# Altium project BLDCdriverI2C.PrjPcb
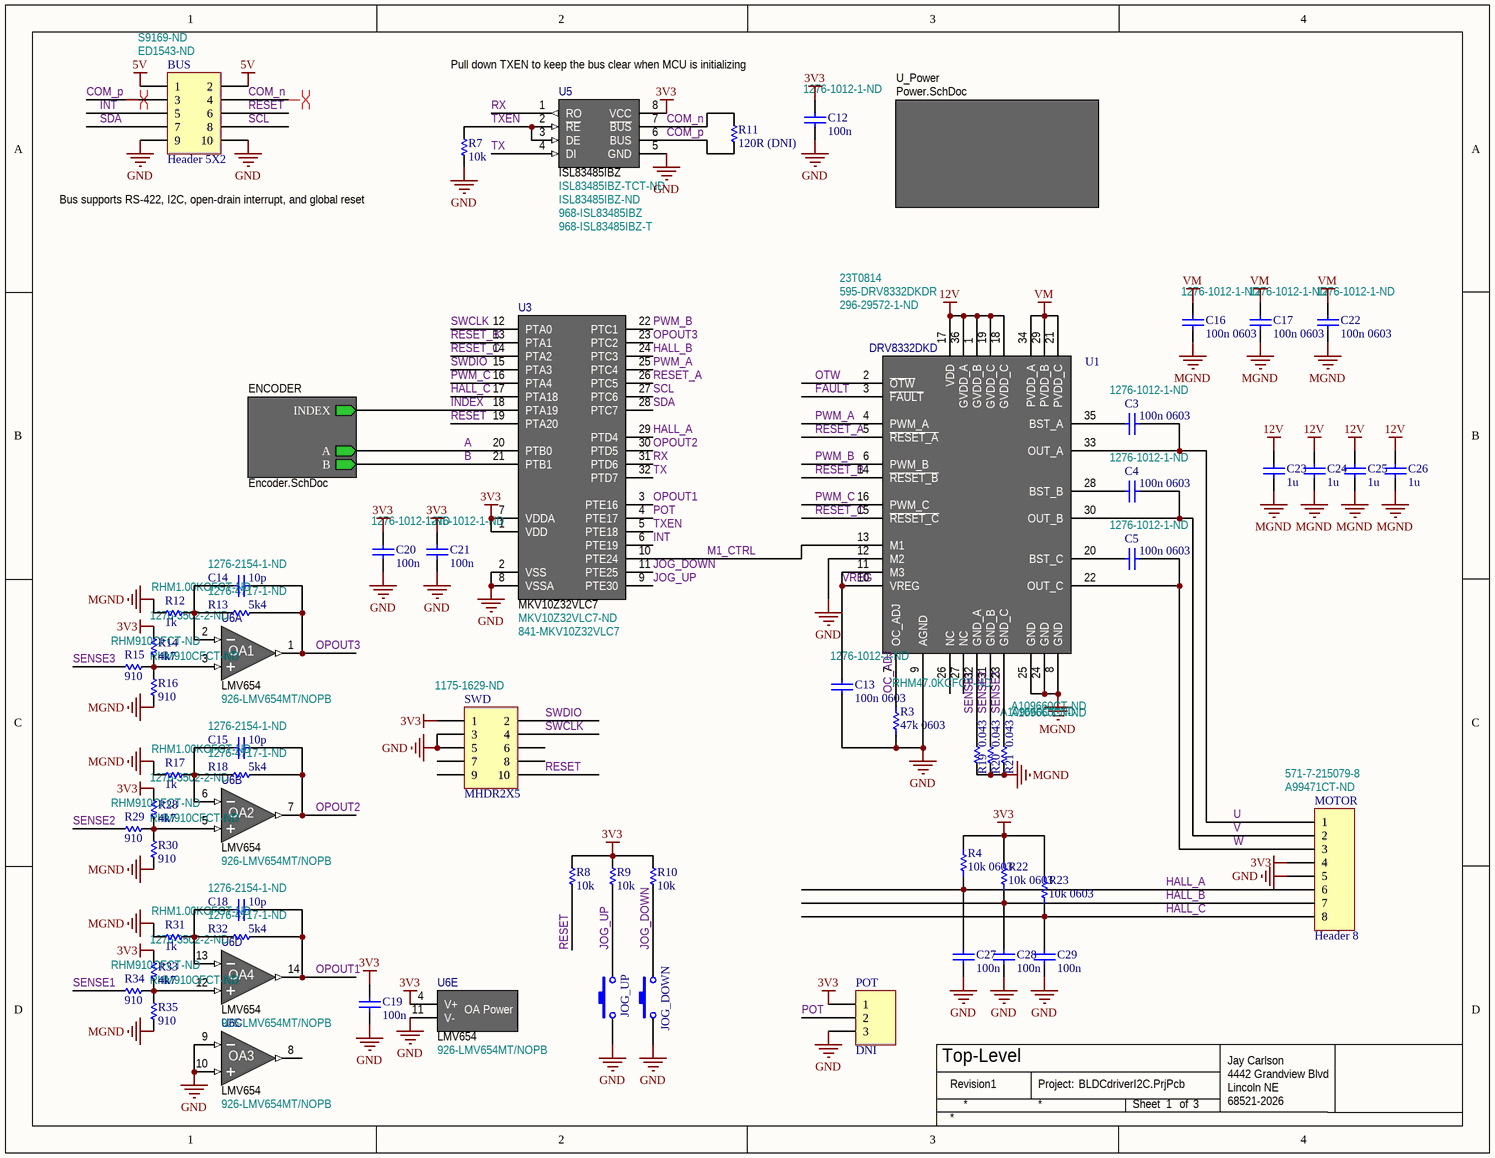
[diagram p0: Top.SchDoc]
3 sheets, 77 parts. Net scope: hierarchical (ports join the sheet entries above them; power ports are global).
Board file: PCB.PcbDoc
Sheets:
  Top.SchDoc
    ENCODER = Encoder.SchDoc
    U_Power = Power.SchDoc

## Sheet Top.SchDoc: Top-Level
size Letter; Organization: Altium Limited; Address1: L3, 12a Rodborough Rd; Address2: Frenchs Forest; Address3: NSW; Address4: Australia 2086; DocumentNumber: 4; Revision: 1; SheetNumber: 1; SheetTotal: 3

### Parts
BUS  Header 5X2  Supplier Part Number 1: ED1543-ND  Supplier Part Number 2: S9169-ND  [HDR2X5_SHROUDED]
C3  100n 0603  Supplier Part Number 1: 1276-1012-1-ND  [CAPC1608N]
C4  100n 0603  Supplier Part Number 1: 1276-1012-1-ND  [CAPC1608N]
C5  100n 0603  Supplier Part Number 1: 1276-1012-1-ND  [CAPC1608N]
C12  100n  Supplier Part Number 1: 1276-1012-1-ND  [CAPC1608N]
C13  100n 0603  Supplier Part Number 1: 1276-1012-1-ND  [CAPC1608N]
C14  10p  Supplier Part Number 1: 1276-2154-1-ND  [CAPC1608N]
C15  10p  Supplier Part Number 1: 1276-2154-1-ND  [CAPC1608N]
C16  100n 0603  Supplier Part Number 1: 1276-1012-1-ND  [CAPC1608N]
C17  100n 0603  Supplier Part Number 1: 1276-1012-1-ND  [CAPC1608N]
C18  10p  Supplier Part Number 1: 1276-2154-1-ND  [CAPC1608N]
C19  100n  [CAPC1608N]
C20  100n  Supplier Part Number 1: 1276-1012-1-ND  [CAPC1608N]
C21  100n  Supplier Part Number 1: 1276-1012-1-ND  [CAPC1608N]
C22  100n 0603  Supplier Part Number 1: 1276-1012-1-ND  [CAPC1608N]
C23  1u  [CAPC1608N]
C24  1u  [CAPC1608N]
C25  1u  [CAPC1608N]
C26  1u  [CAPC1608N]
C27  100n  [CAPC1608N]
C28  100n  [CAPC1608N]
C29  100n  [CAPC1608N]
JOG_DOWN  SW-PB  [SW/PB-SMD/H8]  (value not drawn)
JOG_UP  SW-PB  [SW/PB-SMD/H8]  (value not drawn)
MOTOR  Header 8  Supplier Part Number 1: A99471CT-ND  Supplier Part Number 2: 571-7-215079-8  [7-215079-8]
POT  DNI  [HDR1X3]  (no BOM)
R3  47k 0603  Supplier Part Number 1: RHM47.0KCFCT-ND  [RESC1608N]
R4  10k 0603  [RESC1608N]
R7  10k  [RESC1608N]
R8  10k  [RESC1608N]
R9  10k  [RESC1608N]
R10  10k  [RESC1608N]
R11  120R (DNI)  [RESC1608N]
R12  1k  Supplier Part Number 1: RHM1.00KCFCT-ND  [RESC1608N]
R13  5k4  Supplier Part Number 1: 1276-4717-1-ND  [RESC1608N]
R14  4k7  Supplier Part Number 1: 1276-3502-2-ND  [RESC1608N]
R15  910  Supplier Part Number 1: RHM910CFCT-ND  [RESC1608N]
R16  910  Supplier Part Number 1: RHM910CFCT-ND  [RESC1608N]
R17  1k  Supplier Part Number 1: RHM1.00KCFCT-ND  [RESC1608N]
R18  5k4  Supplier Part Number 1: 1276-4717-1-ND  [RESC1608N]
R19  0.043  Supplier Part Number 1: A109660CT-ND  [RESC3216N]
R20  0.043  Supplier Part Number 1: A109660CT-ND  [RESC3216N]
R21  0.043  Supplier Part Number 1: A109660CT-ND  [RESC3216N]
R22  10k 0603  [RESC1608N]
R23  10k 0603  [RESC1608N]
R28  4k7  Supplier Part Number 1: 1276-3502-2-ND  [RESC1608N]
R29  910  Supplier Part Number 1: RHM910CFCT-ND  [RESC1608N]
R30  910  Supplier Part Number 1: RHM910CFCT-ND  [RESC1608N]
R31  1k  Supplier Part Number 1: RHM1.00KCFCT-ND  [RESC1608N]
R32  5k4  Supplier Part Number 1: 1276-4717-1-ND  [RESC1608N]
R33  4k7  Supplier Part Number 1: 1276-3502-2-ND  [RESC1608N]
R34  910  Supplier Part Number 1: RHM910CFCT-ND  [RESC1608N]
R35  910  Supplier Part Number 1: RHM910CFCT-ND  [RESC1608N]
SWD  MHDR2X5  Supplier Part Number 1: 1175-1629-ND  [MHDR2X5SMD_SHROUD]
U1  DRV8332DKD  Supplier Part Number 1: 296-29572-1-ND  Supplier Part Number 2: 595-DRV8332DKDR  Supplier Part Number 3: 23T0814  [DKD36]
U3  MKV10Z32VLC7  Supplier Part Number 1: MKV10Z32VLC7-ND  Supplier Part Number 2: 841-MKV10Z32VLC7  [QFP80P900X900-32N]
U5  ISL83485IBZ  Supplier Part Number 1: ISL83485IBZ-TCT-ND  Supplier Part Number 2: ISL83485IBZ-ND  Supplier Part Number 3: 968-ISL83485IBZ  Supplier Part Number 4: 968-ISL83485IBZ-T  [SOIC127P600-8N]
U6  LMV654  Supplier Part Number 2: 926-LMV654MT/NOPB  [TSOP65P640-14AN]  (parts A,B,C,D,E of 5)

### Sub-sheets
ENCODER = Encoder.SchDoc: A (out), B (out), INDEX (out)
U_Power = Power.SchDoc: no entries

### Nets
3V3: C12.2 C19.2 C20.2 C21.2 MOTOR.4 POT.1 R4.1 R8.2 R9.2 R10.2 R14.2 R22.1 R23.1 R28.2 R33.2 SWD.1 U3.1(VDD) U3.7(VDDA) U5.8(VCC) U6.4(V+)
5V: BUS.1 BUS.2
12V: C23.2 C24.2 C25.2 C26.2 U1.1(GVDD_B) U1.17(VDD) U1.18(GVDD_C) U1.19(GVDD_C) U1.36(GVDD_A)
GND: BUS.9 BUS.10 C12.1 C13.2 C19.1 C20.1 C21.1 C27.1 C28.1 C29.1 JOG_DOWN.1 JOG_UP.1 MOTOR.5 POT.3 R3.2 R7.1 SWD.3 SWD.5 U1.9(AGND) U1.12(M2) U3.2(VSS) U3.8(VSSA) U5.5(GND) U6.9(IN_C-) U6.10(IN_C+) U6.11(V-)
MGND: C16.2 C17.2 C22.2 C23.1 C24.1 C25.1 C26.1 R12.1 R16.1 R17.1 R19.1 R20.1 R21.1 R30.1 R31.1 R35.1 U1.8(GND) U1.24(GND) U1.25(GND)
VM: C16.1 C17.1 C22.1 U1.21(PVDD_C) U1.29(PVDD_B) U1.34(PVDD_A)
A: U3.20(PTB0) ; sheet ENCODER/A
B: U3.21(PTB1) ; sheet ENCODER/B
COM_n: BUS.4 R11.2 U5.7(~{BUS})
COM_p: BUS.3 R11.1 U5.6(BUS)
FAULT: U1.3(~{FAULT})
HALL_A: C27.2 MOTOR.6 R4.2 U3.29(PTD4)
HALL_B: C28.2 MOTOR.7 R22.2 U3.24(PTC3)
HALL_C: C29.2 MOTOR.8 R23.2 U3.17(PTA18)
INDEX: U3.18(PTA19) ; sheet ENCODER/INDEX
INT: BUS.5 U3.6(PTE19)
JOG_DOWN: JOG_DOWN.2 R10.1 U3.11(PTE25)
JOG_UP: JOG_UP.2 R9.1 U3.9(PTE30)
M1_CTRL: U1.13(M1) U3.10(PTE24)
OC_ADJ: R3.1 U1.7(OC_ADJ)
OPOUT1: C18.2 R32.2 U3.3(PTE16) U6.14(OUT_D)
OPOUT2: C15.2 R18.2 U3.30(PTD5) U6.7(OUT_B)
OPOUT3: C14.2 R13.2 U3.23(PTC2) U6.1(OUT_A)
OTW: U1.2(~{OTW})
POT: POT.2 U3.4(PTE17)
PWM_A: U1.4(PWM_A) U3.25(PTC4)
PWM_B: U1.6(PWM_B) U3.22(PTC1)
PWM_C: U1.16(PWM_C) U3.16(PTA4)
RESET: BUS.6 R8.1 SWD.10 U3.19(PTA20)
RESET_A: U1.5(~{RESET_A}) U3.26(PTC5)
RESET_B: U1.14(~{RESET_B}) U3.13(PTA1)
RESET_C: U1.15(~{RESET_C}) U3.14(PTA2)
RX: U3.31(PTD6) U5.1(RO)
SCL: BUS.8 U3.27(PTC6)
SDA: BUS.7 U3.28(PTC7)
SENSE1: R19.2 R34.1 U1.32(GND_A)
SENSE2: R20.2 R29.1 U1.31(GND_B)
SENSE3: R15.1 R21.2 U1.23(GND_C)
SWCLK: SWD.4 U3.12(PTA0)
SWDIO: SWD.2 U3.15(PTA3)
TX: U3.32(PTD7) U5.4(DI)
TXEN: R7.2 U3.5(PTE18) U5.2(~{RE}) U5.3(DE)
U: C3.1 MOTOR.1 U1.33(OUT_A)
V: C4.1 MOTOR.2 U1.30(OUT_B)
VREG: C13.1 U1.10(VREG) U1.11(M3)
W: C5.1 MOTOR.3 U1.22(OUT_C)
NetC3_2: C3.2 U1.35(BST_A)
NetC4_2: C4.2 U1.28(BST_B)
NetC5_2: C5.2 U1.20(BST_C)
NetC14_1: C14.1 R12.2 R13.1 U6.2(IN_A-)
NetC15_1: C15.1 R17.2 R18.1 U6.6(IN_B-)
NetC18_1: C18.1 R31.2 R32.1 U6.13(IN_D-)
NetR14_1: R14.1 R15.2 R16.2 U6.3(IN_A+)
NetR28_1: R28.1 R29.2 R30.2 U6.5(IN_B+)
NetR33_1: R33.1 R34.2 R35.2 U6.12(IN_D+)

Not connected (* = marked no-connect by the designer): SWD 6 7 8 9; U1 26(NC) 27(NC); U6 8(OUT_C)

### Layout directives
differential pair: COM_n, COM_p

### Notes on the sheet
- Pull down TXEN to keep the bus clear when MCU is initializing
- Bus supports RS-422, I2C, open-drain interrupt, and global reset
- Revision
- Project:
- Sheet
- of
- Jay Carlson
  4442 Grandview Blvd
  Lincoln NE 68521-2026
- (in symbol LMV654, part A) OA1
- (in symbol LMV654, part B) OA2
- (in symbol LMV654, part C) OA3
- (in symbol LMV654, part D) OA4
- (in symbol LMV654, part E) OA Power

### Library data of the parts
BUS = Header 5X2: Header, 5-Pin, Dual row; LatestRevisionDate: 17-Jul-2002; LatestRevisionNote: Re-released for DXP Platform.; Publisher: Altium Limited; Supplier 1: Digi-Key; Supplier 2: Digi-Key
C3-C5 C13 C16 C17 C22 = Cap: Capacitor; Published: 8-Jun-2000; LatestRevisionDate: 17-Jul-2002; LatestRevisionNote: Re-released for DXP Platform.; PackageReference: RAD-0.3; Publisher: Altium Limited; PackageDescription: Radial Cap, Thru-Hole; 2 Leads; 0.3 in Pin Spacing; Supplier 1: Digi-Key
C12 C14 C15 C18-C21 C23-C29 = Cap Semi: Capacitor (Semiconductor SIM Model); Published: 8-Jun-2000; LatestRevisionDate: 29-May-2009; LatestRevisionNote: IPC-7351 Footprint Added.; PackageReference: C1206; Publisher: Altium Limited; PackageDescription: Chip Capacitor
  C12 C14 C15 C18 C20 C21: Supplier 1: Digi-Key
JOG_DOWN JOG_UP = SW-PB: Switch; Published: 24-Mar-1999; LatestRevisionDate: 17-Jul-2002; LatestRevisionNote: Re-released for DXP Platform.; PackageReference: SPST-2; Publisher: Altium Limited; PackageDescription: Switch; 2 Leads; Supplier 1: Digi-Key; Supplier Part Number 1: 450-1129-ND
MOTOR = Header 8: Header, 8-Pin; LatestRevisionDate: 17-Jul-2002; LatestRevisionNote: Re-released for DXP Platform.; Publisher: Altium Limited; Supplier 1: Digi-Key; Supplier 2: Mouser
POT = Header 3: Header, 3-Pin; LatestRevisionDate: 17-Jul-2002; LatestRevisionNote: Re-released for DXP Platform.; Publisher: Altium Limited
R3 R4 R7-R23 R28-R35 = Res Semi: Semiconductor Resistor; Published: 8-Jun-2000; LatestRevisionDate: 17-Jul-2002; LatestRevisionNote: Re-released for DXP Platform.; PackageReference: AXIAL-0.5; Publisher: Altium Limited; PackageDescription: Axial Device, Thru-Hole; 2 Leads; 0.5 in Pin Spacing
  R3 R12-R21 R28-R35: Supplier 1: Digi-Key
  R4 R22 R23: Value: 10k
SWD = MHDR2X5: Header, 5-Pin, Dual row; LatestRevisionDate: 17-Jul-2002; LatestRevisionNote: Re-released for DXP Platform.; Publisher: Altium Limited; Supplier 1: Digi-Key
U3 = MKV10Z32VLC7: Kinetis Cortex-M0+75 MHz Motor Control; Supplier 1: Digi-Key; Supplier 2: Mouser
U5 = ISL83485IBZ: Half-duplex differential transceiver, 10 Mbps; Supplier 1: Digi-Key; Supplier 2: Digi-Key; Supplier 3: Mouser; Supplier 4: Mouser
U6 = LMV654: 12 MHz, Low Voltage, Low Power Amplifiers; Supplier 1: Digi-Key; Supplier Part Number 1: LMV654MT/NOPB-ND; Supplier 2: Mouser
U1 = DRV8332DKD: Supplier 1: Digi-Key; Supplier 2: Mouser; Supplier 3: Newark

## Sheet Encoder.SchDoc
size A
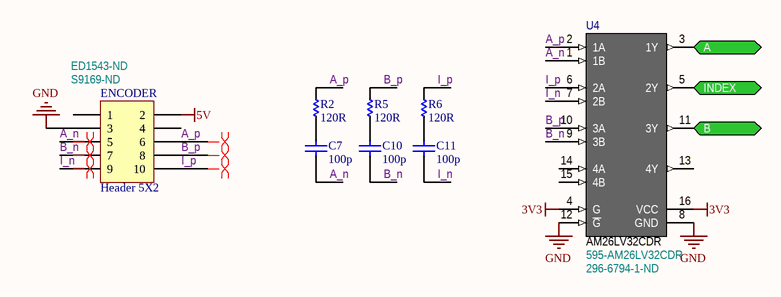
[diagram p1: Encoder.SchDoc]

### Parts
C7  100p  [CAPC1608N]
C10  100p  [CAPC1608N]
C11  100p  [CAPC1608N]
ENCODER  Header 5X2  Supplier Part Number 1: S9169-ND  Supplier Part Number 2: ED1543-ND  [HDR2X5_SHROUDED]
R2  120R  [RESC1608N]
R5  120R  [RESC1608N]
R6  120R  [RESC1608N]
U4  AM26LV32CDR  Supplier Part Number 1: 595-AM26LV32CDR  Supplier Part Number 2: 296-6794-1-ND  [SOIC127P600-16N]

### Ports
A (out), B (out), INDEX (out)

### Nets
3V3: U4.4(G) U4.16(VCC)
5V: ENCODER.2
GND: ENCODER.3 U4.8(GND) U4.12(~{G})
A: U4.3(1Y) ; port A
A_n: C7.1 ENCODER.5 U4.1(1B)
A_p: ENCODER.6 R2.2 U4.2(1A)
B: U4.11(3Y) ; port B
B_n: C10.1 ENCODER.7 U4.9(3B)
B_p: ENCODER.8 R5.2 U4.10(3A)
I_n: C11.1 ENCODER.9 U4.7(2B)
I_p: ENCODER.10 R6.2 U4.6(2A)
INDEX: U4.5(2Y) ; port INDEX
NetC7_2: C7.2 R2.1
NetC10_2: C10.2 R5.1
NetC11_2: C11.2 R6.1

Not connected (* = marked no-connect by the designer): ENCODER 1 4; U4 13(4Y) 14(4A) 15(4B)

### Layout directives
differential pair: A_n, A_p, B_n, B_p, I_n, I_p

### Library data of the parts
C7 C10 C11 = Cap Semi: Capacitor (Semiconductor SIM Model); Published: 8-Jun-2000; LatestRevisionDate: 29-May-2009; LatestRevisionNote: IPC-7351 Footprint Added.; PackageReference: C1206; Publisher: Altium Limited; PackageDescription: Chip Capacitor
ENCODER = Header 5X2: Header, 5-Pin, Dual row; LatestRevisionDate: 17-Jul-2002; LatestRevisionNote: Re-released for DXP Platform.; Publisher: Altium Limited; Supplier 1: Digi-Key; Supplier 2: Digi-Key
R2 R5 R6 = Res Semi: Semiconductor Resistor; Published: 8-Jun-2000; LatestRevisionDate: 17-Jul-2002; LatestRevisionNote: Re-released for DXP Platform.; PackageReference: AXIAL-0.5; Publisher: Altium Limited; PackageDescription: Axial Device, Thru-Hole; 2 Leads; 0.5 in Pin Spacing
U4 = AM26LV32CDR: Quad differential receiver; Supplier 1: Mouser; Supplier 2: Digi-Key

## Sheet Power.SchDoc
size A
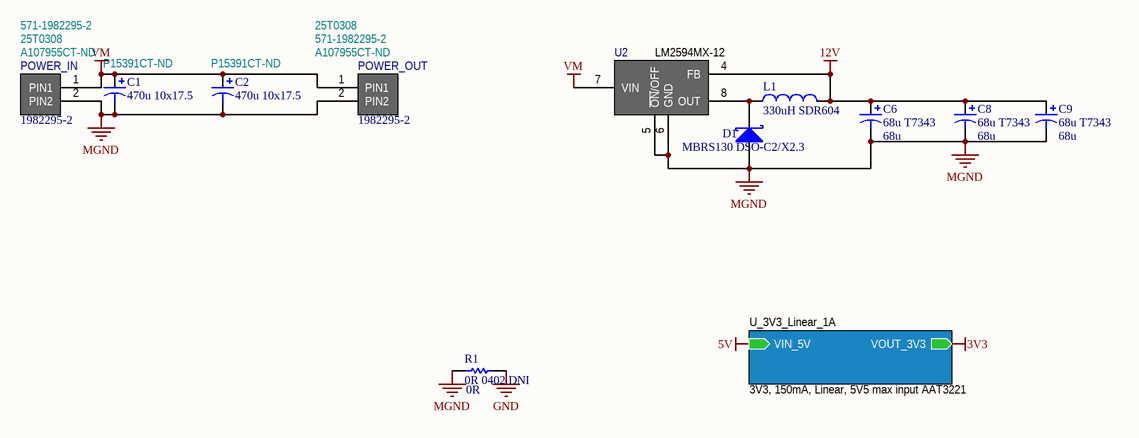
[diagram p2: Power.SchDoc]

### Parts
C1  470u 10x17.5  Supplier Part Number 1: P15391CT-ND  [CAPPR5-10x17.5]
C2  470u 10x17.5  Supplier Part Number 1: P15391CT-ND  [CAPPR5-10x17.5]
C6  68u T7343  value 68u  [TC7343-2917]
C8  68u T7343  value 68u  [TC7343-2917]
C9  68u T7343  value 68u  [TC7343-2917]
D1  MBRS130 DSO-C2/X2.3  [DSO-C2/X2.3]
L1  330uH SDR604  [SDR604]
POWER_IN  1982295-2  Supplier Part Number 1: A107955CT-ND  Supplier Part Number 2: 25T0308  Supplier Part Number 3: 571-1982295-2  [1982295-2]
POWER_OUT  1982295-2  Supplier Part Number 1: A107955CT-ND  Supplier Part Number 2: 571-1982295-2  Supplier Part Number 3: 25T0308  [1982295-2]
R1  0R 0402 DNI  value 0R  [RESC2012N]
U2  LM2594MX-12  [SOIC127P600-8CN]

### Sub-sheets
U_3V3_Linear_1A = 3V3, 150mA, Linear, 5V5 max input AAT3221 (file not in this document): VIN_5V (in), VOUT_3V3 (out)

### Nets
12V: C6.1 C8.1 C9.1 L1.2 U2.4(FB)
GND: R1.1
MGND: C1.2 C2.2 C6.2 C8.2 C9.2 D1.1(A) POWER_IN.2(PIN2) POWER_OUT.2(PIN2) R1.2 U2.5(~{ON}/OFF) U2.6(GND)
VM: C1.1 C2.1 POWER_IN.1(PIN1) POWER_OUT.1(PIN1) U2.7(VIN)
NetD1_2: D1.2(K) L1.1 U2.8(OUT)

### Library data of the parts
C1 C2 C6 C8 C9 = Cap Pol1: Polarized Capacitor (Radial); Published: 8-Jun-2000; LatestRevisionDate: 17-Jul-2002; LatestRevisionNote: Re-released for DXP Platform.; PackageReference: RB7.6-15; Publisher: Altium Limited; PackageDescription: Polarized Capacitor (Radial); 2 Leads; Supplier 1: Digi-Key
  C6 C8 C9: Supplier Part Number 1: 495-1561-1-ND
D1 = D Schottky: Schottky Diode; Published: 8-Jun-2000; LatestRevisionDate: 17-Jul-2002; LatestRevisionNote: Re-released for DXP Platform.; PackageReference: SMB; Publisher: Altium Limited; PackageDescription: DO-214-AA/SMB; 2 C-Bend Leads; Body 5.3 x 3.6 mm, inc. leads (LxW); Code_JEDEC: DO-214-AA; Supplier 1: Digi-Key; Supplier Part Number 1: MBRS130FSCT-ND
L1 = Inductor: Code_IEC: 1005; Value: 330u; Published: 8-Jun-2000; LatestRevisionDate: 29-May-2009; LatestRevisionNote: IPC-7351 Footprint Added.; PackageReference: 0402-A; Publisher: Altium Limited; PackageDescription: Chip Inductor; Code_JEITA: 0402; Supplier 1: Digi-Key; Supplier Part Number 1: SDR0604-331KLCT-ND
R1 = Res Semi: Semiconductor Resistor; Published: 8-Jun-2000; LatestRevisionDate: 17-Jul-2002; LatestRevisionNote: Re-released for DXP Platform.; PackageReference: AXIAL-0.5; Publisher: Altium Limited; PackageDescription: Axial Device, Thru-Hole; 2 Leads; 0.5 in Pin Spacing
POWER_IN POWER_OUT = 1982295-2: Supplier 1: Digi-Key
  POWER_IN: Supplier 2: Newark; Supplier 3: Mouser
  POWER_OUT: Supplier 2: Mouser; Supplier 3: Newark
U2 = LM2594MX-12: Supplier 1: Digi-Key; Supplier Part Number 1: LM2594M-12/NOPB-ND

## Nets that join several sheets
3V3: Top (20 pins), Encoder (U4.4 U4.16)
5V: Top (BUS.1 BUS.2), Encoder (ENCODER.2)
12V: Top (9 pins), Power (5 pins)
GND: Top (26 pins), Encoder (ENCODER.3 U4.8 U4.12), Power (R1.1)
MGND: Top (19 pins), Power (11 pins)
VM: Top (6 pins), Power (5 pins)
A: Top (U3.20), Encoder (U4.3)
B: Top (U3.21), Encoder (U4.11)
INDEX: Top (U3.18), Encoder (U4.5)